# EAGLE schematic PCB_rev2_board (EAGLE 9.5.2)
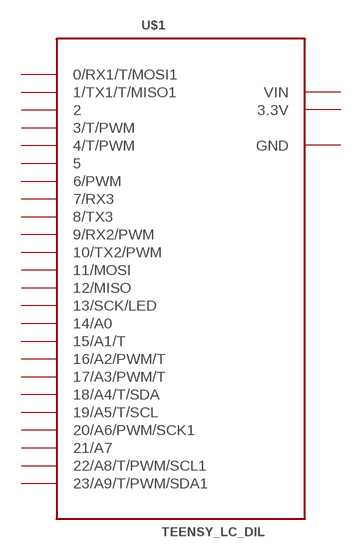
[diagram p0: schematic, sheet 1]

## Parts
U$1  TEENSY_LC_DIL  [TEENSY_3.0-3.2&LC_DIL]
Unconnected: U$1.0(0/RX1/T/MOSI1) U$1.1(1/TX1/T/MISO1) U$1.2 U$1.3(3/T/PWM) U$1.4(4/T/PWM) U$1.5 U$1.6(6/PWM) U$1.7(7/RX3) U$1.8(8/TX3) U$1.9(9/RX2/PWM) U$1.10(10/TX2/PWM) U$1.11(11/MOSI) U$1.12(12/MISO) U$1.13(13/SCK/LED) U$1.14/A0 U$1.15/A1(15/A1/T) U$1.16/A2(16/A2/PWM/T) U$1.17/A3(17/A3/PWM/T) U$1.18/A4(18/A4/T/SDA) U$1.19/A5(19/A5/T/SCL) U$1.20/A6(20/A6/PWM/SCK1) U$1.21/A7 U$1.22/A8(22/A8/T/PWM/SCL1) U$1.23/A9(23/A9/T/PWM/SDA1)

## Power pins joined to a net without a drawn wire
3.3V: U$1.3.3V
GND: U$1.AGND(GND) U$1.GND
VIN: U$1.VIN

## Library data of the parts
U$1 = Teensy_3_and_LC_Series_Boards_v1.4:TEENSY_LC_DIL